# EAGLE design cape (EAGLE 7.5.0)
CNAME: Sebastián Sáez
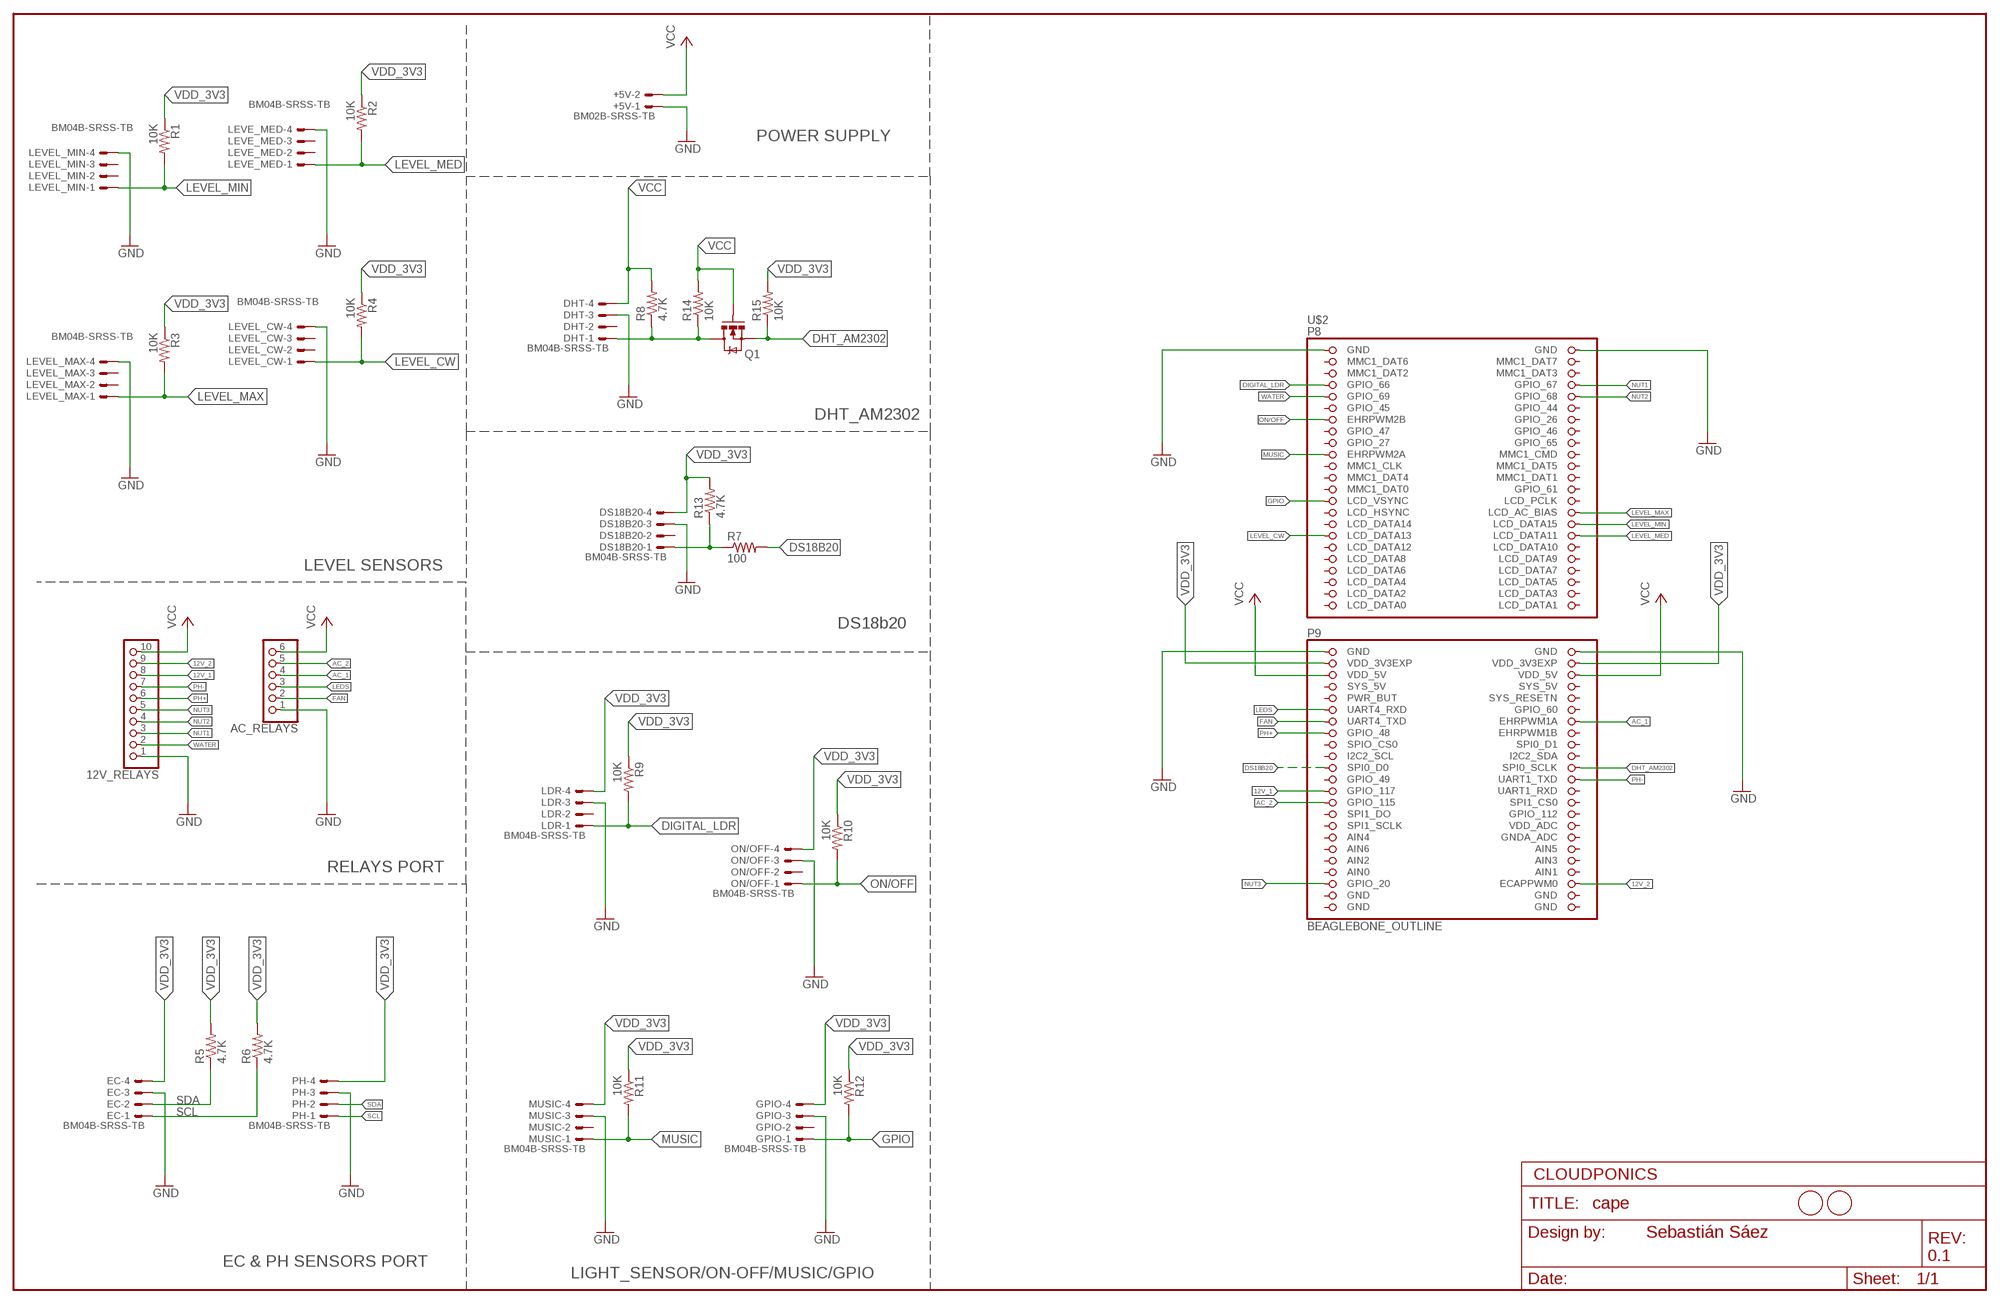
[diagram p0: schematic, sheet 1]

## Parts
12V_RELAYS  PINHD-1X10  [1X10-BIG]
+5V  BM02B-SRSS-TB  [BM02B-SRSS-TB]
AC_RELAYS  PINHD-1X6B  [1X06-BIG]
DHT  BM04B-SRSS-TB  [BM04B-SRSS-TB]
DS18B20  BM04B-SRSS-TB  [BM04B-SRSS-TB]
EC  BM04B-SRSS-TB  [BM04B-SRSS-TB]
FRAME1  FRAME-LEDGER  [CREATIVE_COMMONS]
GPIO  BM04B-SRSS-TB  [BM04B-SRSS-TB]
LDR  BM04B-SRSS-TB  [BM04B-SRSS-TB]
LEVE_MED  BM04B-SRSS-TB  [BM04B-SRSS-TB]
LEVEL_CW  BM04B-SRSS-TB  [BM04B-SRSS-TB]
LEVEL_MAX  BM04B-SRSS-TB  [BM04B-SRSS-TB]
LEVEL_MIN  BM04B-SRSS-TB  [BM04B-SRSS-TB]
MUSIC  BM04B-SRSS-TB  [BM04B-SRSS-TB]
ON/OFF  BM04B-SRSS-TB  [BM04B-SRSS-TB]
PH  BM04B-SRSS-TB  [BM04B-SRSS-TB]
Q1  MOSFET-NCHANNELBSS123LT1G  [SOT23-3]
R1  10K  R-US_R0805  [R0805]
R2  10K  R-US_R0805  [R0805]
R3  10K  R-US_R0805  [R0805]
R4  10K  R-US_R0805  [R0805]
R5  4.7K  R-US_R0805  [R0805]
R6  4.7K  R-US_R0805  [R0805]
R7  100  R-US_R0805  [R0805]
R8  4.7K  R-US_R0805  [R0805]
R9  10K  R-US_R0805  [R0805]
R10  10K  R-US_R0805  [R0805]
R11  10K  R-US_R0805  [R0805]
R12  10K  R-US_R0805  [R0805]
R13  4.7K  R-US_R0805  [R0805]
R14  10K  R-US_R0805  [R0805]
R15  10K  R-US_R0805  [R0805]
U$1  FIDUCIAL  [FIDUCIAL_1MM]
U$2  BEAGLEBONE_OUTLINE  [BEAGLEBONE_SHIELD]
U$3  FIDUCIAL  [FIDUCIAL_1MM]

## Nets
12V_1: 12V_RELAYS.8 U$2.71(GPIO_117)
12V_2: 12V_RELAYS.9 U$2.88(ECAPPWM0)
AC_1: AC_RELAYS.4 U$2.60(EHRPWM1A)
AC_2: AC_RELAYS.5 U$2.73(GPIO_115)
DHT_AM2302: Q1.2(S) R15.1 U$2.68(SPI0_SCLK)
DIGITAL_LDR: LDR.1 R9.2 U$2.7(GPIO_66)
DS18B20: R7.2 U$2.67(SPI0_D0)
FAN: AC_RELAYS.2 U$2.59(UART4_TXD)
GND: 12V_RELAYS.1 +5V.1 AC_RELAYS.1 DHT.3 DS18B20.3 EC.3 GPIO.3 LDR.3 LEVE_MED.4 LEVEL_MAX.4 LEVEL_MIN.4 MUSIC.3 ON/OFF.3 PH.3 U$2.1(GND) U$2.2(GND) U$2.47(GND) U$2.48(GND)
GPIO: GPIO.1 R12.2 U$2.27(LCD_VSYNC)
LEDS: AC_RELAYS.3 U$2.57(UART4_RXD)
LEVE_CW: LEVEL_CW.4 ; supply symbol labelled GND
LEVEL_CW: LEVEL_CW.1 R4.2 U$2.33(LCD_DATA13)
LEVEL_MAX: LEVEL_MAX.1 R3.2 U$2.30(LCD_AC_BIAS)
LEVEL_MED: LEVE_MED.1 R2.2 U$2.34(LCD_DATA11)
LEVEL_MIN: LEVEL_MIN.1 R1.2 U$2.32(LCD_DATA15)
MUSIC: MUSIC.1 R11.2 U$2.19(EHRPWM2A)
N1: DS18B20.1 R7.1 R13.1
N$1: DHT.1 Q1.3(D) R8.1 R14.1
NUT1: 12V_RELAYS.3 U$2.8(GPIO_67)
NUT2: 12V_RELAYS.4 U$2.10(GPIO_68)
NUT3: 12V_RELAYS.5 U$2.87(GPIO_20)
ON/OFF: ON/OFF.1 R10.2 U$2.13(EHRPWM2B)
PH+: 12V_RELAYS.6 U$2.61(GPIO_48)
PH-: 12V_RELAYS.7 U$2.70(UART1_TXD)
SCL: EC.1 PH.1 R6.1
SDA: EC.2 PH.2 R5.1
VCC: 12V_RELAYS.10 +5V.2 AC_RELAYS.6 DHT.4 Q1.1(G) R8.2 R14.2 U$2.51(VDD_5V) U$2.52(VDD_5V)
VDD_3V3: DS18B20.4 EC.4 GPIO.4 LDR.4 MUSIC.4 ON/OFF.4 PH.4 R1.1 R2.1 R3.1 R4.1 R5.2 R6.2 R9.1 R10.1 R11.1 R12.1 R13.2 R15.2 U$2.49(VDD_3V3EXP) U$2.50(VDD_3V3EXP)
WATER: 12V_RELAYS.2 U$2.9(GPIO_69)
Unconnected: DHT.2 DS18B20.2 GPIO.2 LDR.2 LEVE_MED.2 LEVE_MED.3 LEVEL_CW.2 LEVEL_CW.3 LEVEL_MAX.2 LEVEL_MAX.3 LEVEL_MIN.2 LEVEL_MIN.3 MUSIC.2 ON/OFF.2 U$2.3(MMC1_DAT6) U$2.4(MMC1_DAT7) U$2.5(MMC1_DAT2) U$2.6(MMC1_DAT3) U$2.11(GPIO_45) U$2.12(GPIO_44) U$2.14(GPIO_26) U$2.15(GPIO_47) U$2.16(GPIO_46) U$2.17(GPIO_27) U$2.18(GPIO_65) U$2.20(MMC1_CMD) U$2.21(MMC1_CLK) U$2.22(MMC1_DAT5) U$2.23(MMC1_DAT4) U$2.24(MMC1_DAT1) U$2.25(MMC1_DAT0) U$2.26(GPIO_61) U$2.28(LCD_PCLK) U$2.29(LCD_HSYNC) U$2.31(LCD_DATA14) U$2.35(LCD_DATA12) U$2.36(LCD_DATA10) U$2.37(LCD_DATA8) U$2.38(LCD_DATA9) U$2.39(LCD_DATA6) U$2.40(LCD_DATA7) U$2.41(LCD_DATA4) U$2.42(LCD_DATA5) U$2.43(LCD_DATA2) U$2.44(LCD_DATA3) U$2.45(LCD_DATA0) U$2.46(LCD_DATA1) U$2.54(SYS_5V) U$2.55(PWR_BUT) U$2.56(SYS_RESETN) U$2.58(GPIO_60) U$2.62(EHRPWM1B) U$2.63(SPIO_CS0) U$2.64(SPI0_D1) U$2.65(I2C2_SCL) U$2.66(I2C2_SDA) U$2.69(GPIO_49) U$2.72(UART1_RXD) U$2.74(SPI1_CS0) U$2.75(SPI1_DO) U$2.76(GPIO_112) U$2.77(SPI1_SCLK) U$2.78(VDD_ADC) U$2.79(AIN4) U$2.80(GNDA_ADC) U$2.81(AIN6) U$2.82(AIN5) U$2.83(AIN2) U$2.84(AIN3) U$2.86(AIN1)

## Notes on the sheet
- POWER SUPPLY
- DHT_AM2302
- LEVEL SENSORS
- DS18b20
- RELAYS PORT
- EC & PH SENSORS PORT
- LIGHT_SENSOR/ON-OFF/MUSIC/GPIO

## Power pins joined to a net without a drawn wire
AIN0: U$2.85(AIN0)
GND: U$2.89(GND) U$2.90(GND) U$2.91(GND) U$2.92(GND)
SYS_5V: U$2.53(SYS_5V)

## Library data of the parts
12V_RELAYS = adafruit:PINHD-1X10: Pin header 1x10 0.1" spacing With round pins
+5V = con-jst:?M02B-SRSS-TB: Disconnectable Crimp style connector, 1.0mm pitch 2 contacts
AC_RELAYS = adafruit:PINHD-1X6: PIN HEADER
DHT DS18B20 EC GPIO LDR LEVE_MED LEVEL_CW LEVEL_MAX LEVEL_MIN MUSIC ON/OFF PH = con-jst:?M04B-SRSS-TB: Disconnectable Crimp style connector, 1.0mm pitch 4 contacts
FRAME1 = SparkFun-Aesthetics:FRAME-LEDGER: Schematic Frame Standard 11x14 US Ledger frame
Q1 = SparkFun-DiscreteSemi:MOSFET-NCHANNEL: Common NMOSFET Parts MFG P/N Store ID Prod ID FDD8780 TRANS-09984 SI7820DN TRANS-11055 FDS6630A IC-08089 2N7002PW TRANS-11151 FQP30N06L COM-10213 TRANS-10060 BSS123LT1G TRANS-08345 BSS138 TRANS-00830 BS170 2N7000; PROD_ID: TRANS-08345
R1-R15 = adafruit:R-US_: RESISTOR, American symbol
U$1 U$3 = adafruit:FIDUCIAL: For use by pick and place machines to calibrate the vision/machine, 1mm By microbuilder.eu
U$2 = adafruit:BEAGLEBONE_OUTLINE: Should match A3 pinout - but not completely tested

## Board
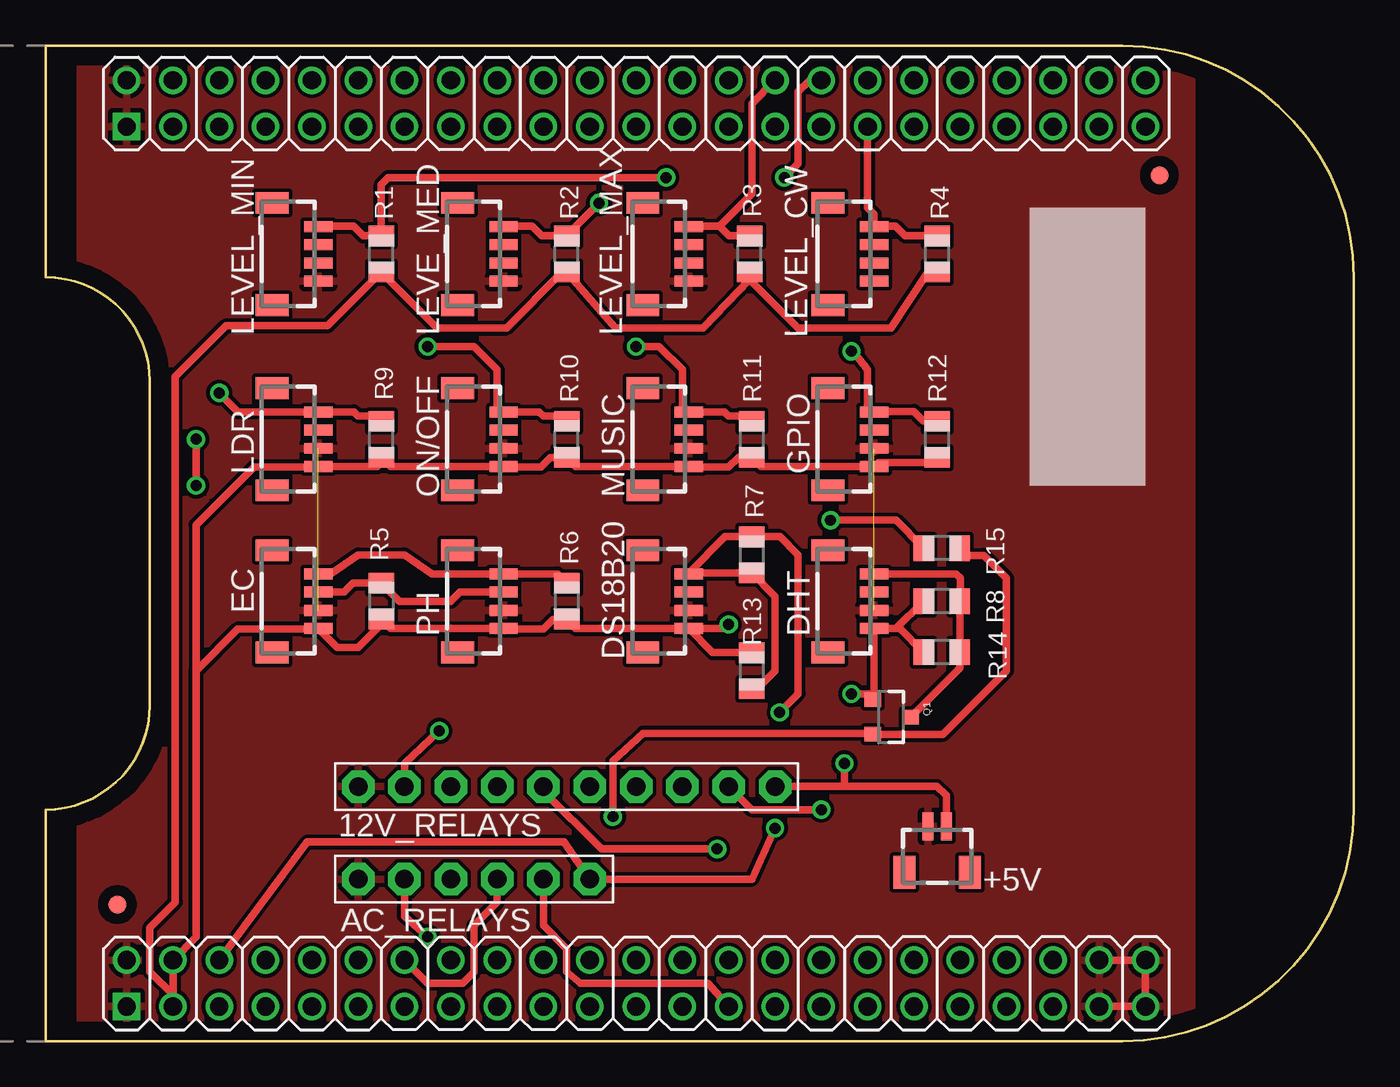
[diagram p1: board, top side]
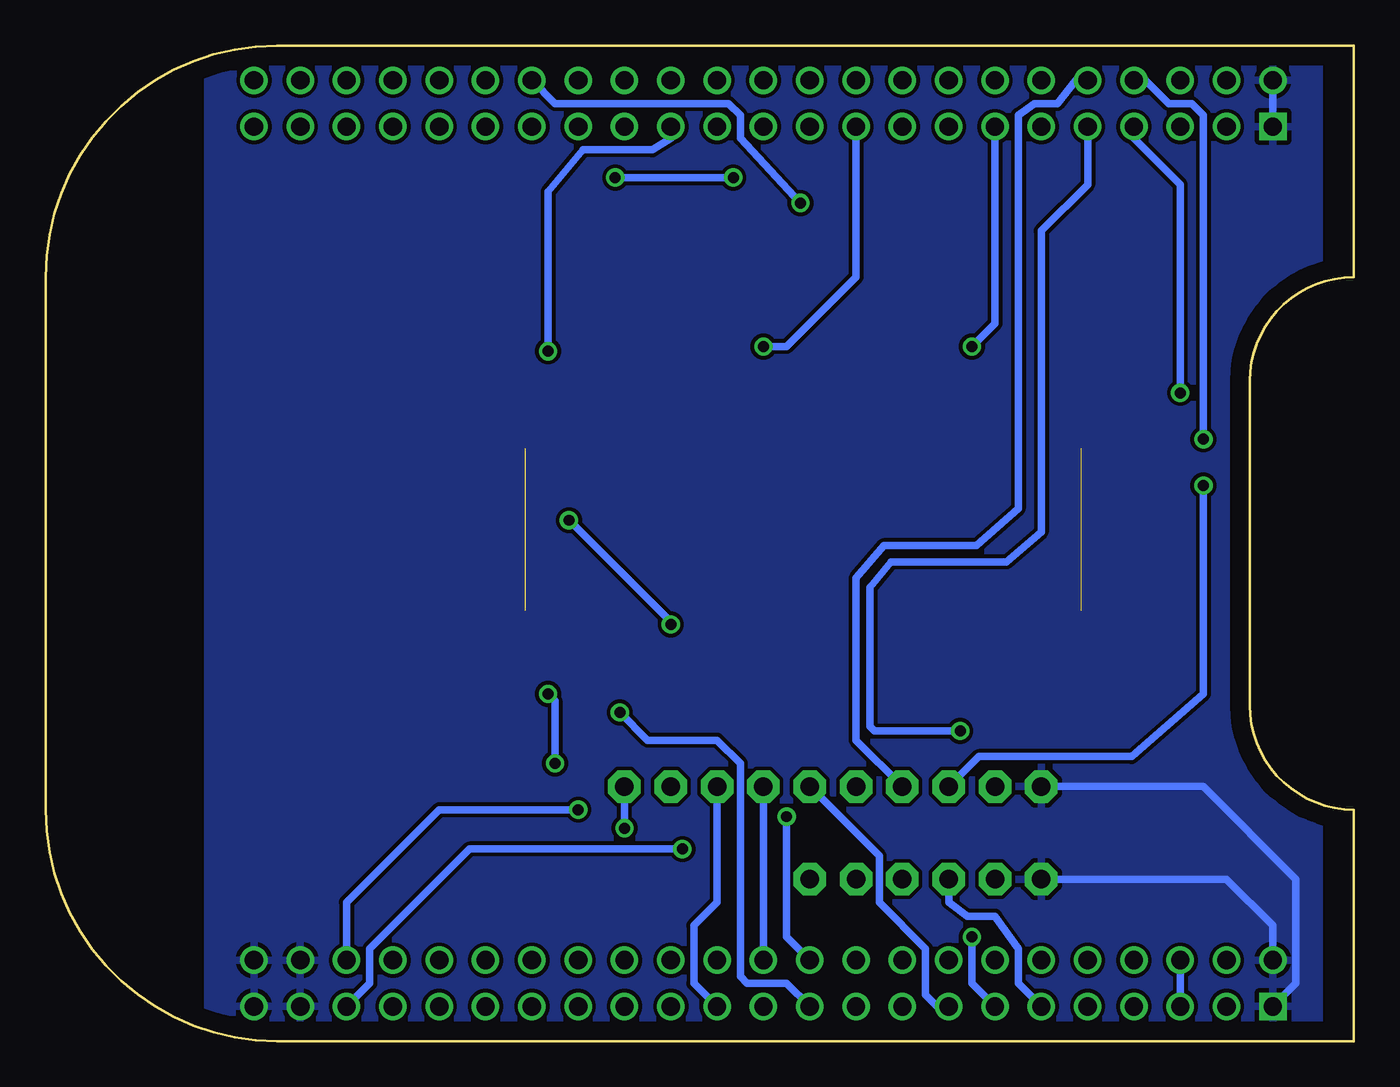
[diagram p2: board, bottom side, seen from below]

Size 71.75 x 54.61 mm. Coordinates in mm from the lower left corner, seen from the top.
Copper layers (1*16): Top 0.035mm / dielectric 1.5mm / Bottom 0.035mm
Design rules "default": minimum track width 10mil, minimum drill 24mil, track to track 8mil, track to pad 8mil, pad to pad 8mil, via to via 8mil, smd to smd 8mil, copper to edge 40mil, drill to drill 8mil, minimum pad ring 10mil, minimum via ring 8mil, stop-mask expansion 4mil, vias tented up to drill 0mil, thermal gap 10mil

### Footprints (pad centres in the part's own frame; a part is rotated, then mirrored left to right if it is on the bottom)
1X10-BIG = drill 1.016 pad 1.778 octagon: 1 -11.43,0; 2 -8.89,0; 3 -6.35,0; 4 -3.81,0; 5 -1.27,0; 6 1.27,0; 7 3.81,0; 8 6.35,0; 9 8.89,0; 10 11.43,0
BM02B-SRSS-TB = smd 0.6 x 1.55: 1 0.5,-1.625; 2 -0.5,-1.625 | smd 1.2 x 1.8: FIT@1 1.8,0.9; FIT@2 -1.8,0.9
1X06-BIG = drill 1.016 pad 1.778 octagon: 1 -6.35,0; 2 -3.81,0; 3 -1.27,0; 4 1.27,0; 5 3.81,0; 6 6.35,0
BM04B-SRSS-TB = smd 0.6 x 1.55: 1 1.5,-1.625; 2 0.5,-1.625; 3 -0.5,-1.625; 4 -1.5,-1.625 | smd 1.2 x 1.8: FIT@1 2.8,0.9; FIT@2 -2.8,0.9
SOT23-3 = smd 0.8 x 0.9: 1 -0.95,-1; 2 0.95,-1; 3 0,1.1
R0805 = smd 1.1 x 1.4: 1 -1,0; 2 1,0
FIDUCIAL_1MM = smd 1 x 1: 1 0,0
BEAGLEBONE_SHIELD = drill 1 square: 1 4.445,19.05; 47 52.705,19.05 | drill 1: 2 1.905,19.05; 3 4.445,21.59; 4 1.905,21.59; 5 4.445,24.13; 6 1.905,24.13; 7 4.445,26.67; 8 1.905,26.67; 9 4.445,29.21; 10 1.905,29.21; 11 4.445,31.75; 12 1.905,31.75; 13 4.445,34.29; 14 1.905,34.29; 15 4.445,36.83; 16 1.905,36.83; 17 4.445,39.37; 18 1.905,39.37; 19 4.445,41.91; 20 1.905,41.91; 21 4.445,44.45; 22 1.905,44.45; 23 4.445,46.99; 24 1.905,46.99; 25 4.445,49.53; 26 1.905,49.53; 27 4.445,52.07; 28 1.905,52.07; 29 4.445,54.61; 30 1.905,54.61; 31 4.445,57.15; 32 1.905,57.15; 33 4.445,59.69; 34 1.905,59.69; 35 4.445,62.23; 36 1.905,62.23; 37 4.445,64.77; 38 1.905,64.77; 39 4.445,67.31; 40 1.905,67.31; 41 4.445,69.85; 42 1.905,69.85; 43 4.445,72.39; 44 1.905,72.39; 45 4.445,74.93; 46 1.905,74.93; 48 50.165,19.05; 49 52.705,21.59; 50 50.165,21.59; 51 52.705,24.13; 52 50.165,24.13; 53 52.705,26.67; 54 50.165,26.67; 55 52.705,29.21; 56 50.165,29.21; 57 52.705,31.75; 58 50.165,31.75; 59 52.705,34.29; 60 50.165,34.29; 61 52.705,36.83; 62 50.165,36.83; 63 52.705,39.37; 64 50.165,39.37; 65 52.705,41.91; 66 50.165,41.91; 67 52.705,44.45; 68 50.165,44.45; 69 52.705,46.99; 70 50.165,46.99; 71 52.705,49.53; 72 50.165,49.53; 73 52.705,52.07; 74 50.165,52.07; 75 52.705,54.61; 76 50.165,54.61; 77 52.705,57.15; 78 50.165,57.15; 79 52.705,59.69; 80 50.165,59.69; 81 52.705,62.23; 82 50.165,62.23; 83 52.705,64.77; 84 50.165,64.77; 85 52.705,67.31; 86 50.165,67.31; 87 52.705,69.85; 88 50.165,69.85; 89 52.705,72.39; 90 50.165,72.39; 91 52.705,74.93; 92 50.165,74.93

### Placement (x,y rotation side)
12V_RELAYS  28.57,13.97 0 top
+5V  48.89,10.16 180 top
AC_RELAYS  23.5,8.89 0 top
DHT  43.81,24.13 90 top
DS18B20  33.66,24.13 90 top
EC  13.33,24.13 90 top
FRAME1  5.71,-12.7 0 top  (outside the outline)
GPIO  43.81,33.02 90 top
LDR  13.33,33.02 90 top
LEVE_MED  23.5,43.18 90 top
LEVEL_CW  43.81,43.18 90 top
LEVEL_MAX  33.66,43.18 90 top
LEVEL_MIN  13.33,43.18 90 top
MUSIC  33.66,33.02 90 top
ON/OFF  23.5,33.02 90 top
PH  23.5,24.13 90 top
Q1  46.35,17.78 270 top
R1  18.41,43.18 90 top
R2  28.57,43.18 90 top
R3  38.61,43.18 90 top
R4  48.89,43.18 90 top
R5  18.41,24.13 270 top
R6  28.57,24.13 270 top
R7  38.73,26.67 90 top
R8  49.15,24.13 180 top
R9  18.41,33.02 90 top
R10  28.57,33.02 90 top
R11  38.73,33.02 90 top
R12  48.89,33.02 90 top
R13  38.73,20.32 90 top
R14  49.15,21.34 180 top
R15  49.15,27.05 180 top
U$1  3.94,7.49 0 top
U$2  -14.61,54.61 270 top
U$3  61.09,47.5 0 top

### Tracks (layer width: path | path; a pad name or v marks a point on that pad's centre or on a via)
12V_1
  Bottom 0.406: 12V_RELAYS.8 34.92,7.62 36.19,6.35 36.19,3.17 U$2.71
12V_2  (via drill 0.6)
  Top 0.406: 12V_RELAYS.9 38.73,12.7 v42.55,12.7
  Bottom 0.406: v42.55,12.7 50.16,12.7 55.24,7.62 U$2.88
AC_1
  Top 0.406: AC_RELAYS.4 24.76,7.62 23.5,6.35 23.5,3.81 22.86,3.17 20.96,3.17 U$2.60
AC_2
  Top 0.406: AC_RELAYS.5 27.3,6.35 28.57,5.08 28.57,3.81 29.34,3.17 36.32,3.17 U$2.73
DHT_AM2302  (via drill 0.6)
  Top 0.406: v31.11,12.32 31.11,15.37 32.77,16.89 44.91,16.89 Q1.2 49.21,16.83 52.7,20.32 52.7,25.4 51.45,26.65 50.55,26.65 R15.1
  Bottom 0.406: v31.11,12.32 31.11,5.71 U$2.68
DIGITAL_LDR  (via drill 0.6)
  Top 0.406: v9.53,35.56 10.57,34.52 LDR.1 16.91,34.52 17.14,34.29 18.14,34.29 R9.2
  Bottom 0.406: v9.53,35.56 9.53,46.99 12.07,49.53 U$2.7
DS18B20  (via drill 0.6)
  Top 0.406: 35.26,25.65 37.27,27.67 R7.2 40.28,27.67 41.27,26.67 41.27,19.05 v40.26,18.03
  Bottom 0.406: U$2.67 31.11,3.17 33.27,3.17 33.66,3.56 33.66,15.24 34.92,16.51 38.73,16.51 v40.26,18.03
FAN  (via drill 0.6)
  Top 0.406: v20.96,5.71 19.68,6.86 AC_RELAYS.2
  Bottom 0.406: U$2.59 20.96,3.17 v20.96,5.71
GND  (2 unrouted)
  Top 0.406: U$2.89 U$2.91 U$2.92 U$2.90
  Bottom 0.406: U$2.2 U$2.1 | U$2.48 4.45,6.35 6.98,8.89 AC_RELAYS.1 | 12V_RELAYS.1 8.25,13.97 3.18,8.89 3.18,3.17 U$2.47
  pour Bottom: 1.9,54.61 62.86,54.61 62.86,0 1.9,0
  pour Top: 1.9,54.61 62.86,54.61 62.86,0 1.9,0
GPIO  (via drill 0.6)
  Top 0.406: R12.2 48.15,34.02 47.62,34.54 45.46,34.54 GPIO.1 45.08,34.88 45.08,36.83 44.58,37.46 v44.2,37.85
  Bottom 0.406: v44.2,37.85 44.2,46.61 42.29,48.89 38.48,48.89 37.47,49.53 U$2.27
LEDS
  Bottom 0.406: U$2.57 18.41,3.17 18.41,5.08 19.68,6.86 21.21,6.86 22.22,7.62 AC_RELAYS.3
LEVEL_CW
  Top 0.406: R4.2 47.13,44.18 46.61,44.7 45.46,44.7 LEVEL_CW.1 45.44,45.36 45.08,45.72 U$2.33
LEVEL_MAX
  Top 0.406: LEVEL_MAX.1 35.3,44.7 36.96,44.7 | 36.96,44.7 37.48,44.18 R3.2 | 36.96,44.7 38.73,46.48 38.73,51.44 U$2.30
LEVEL_MED  (via drill 0.6)
  Top 0.406: v30.35,45.97 R2.2 27.19,44.18 26.67,44.7 25.14,44.7 LEVE_MED.1
  Bottom 0.406: v30.35,45.97 33.66,49.53 33.66,50.8 34.29,51.44 43.81,51.44 U$2.34
LEVEL_MIN  (via drill 0.6)
  Top 0.406: LEVEL_MIN.1 14.98,44.7 16.89,44.7 17.41,44.18 R1.2 18.41,46.99 18.8,47.37 v34.04,47.37 | U$2.32 41.91,52.7 41.27,52.07 41.27,48.13 v40.51,47.37
  Bottom 0.406: v40.51,47.37 v34.04,47.37
MUSIC  (via drill 0.6)
  Top 0.406: R11.2 38.47,34.29 37.47,34.29 37.23,34.52 MUSIC.1 34.92,34.88 34.92,36.83 33.66,38.1 v32.39,38.1
  Bottom 0.406: U$2.19 27.3,41.91 31.11,38.1 v32.39,38.1
N1
  Top 0.406: DS18B20.1 35.32,25.67 R7.1 40,24.4 40,20.32 39,19.32 R13.1
N$1
  Top 0.406: 47.47,17.8 Q1.3 50.15,20.47 R14.1 R8.1 50.16,24.15 50.16,25.4 49.94,25.63 DHT.1
NUT1  (via drill 0.6)
  Top 0.406: v8.25,33.02 v8.25,30.48
  Bottom 0.406: U$2.8 11.43,52.7 10.16,51.44 8.89,51.44 8.25,50.8 v8.25,33.02 | 12V_RELAYS.3 20.57,15.62 12.19,15.62 8.25,19.05 v8.25,30.48
NUT2
  Bottom 0.406: U$2.10 15.24,52.7 16.26,51.44 17.53,51.44 18.41,50.8 18.41,29.21 20.7,27.18 25.78,27.18 27.3,25.4 27.3,16.51 12V_RELAYS.4
NUT3  (via drill 0.6)
  Top 0.406: 12V_RELAYS.5 27.3,13.72 30.48,10.54 v36.83,10.54
  Bottom 0.406: v36.83,10.54 48.51,10.54 53.97,5.08 53.97,3.17 U$2.87
ON/OFF  (via drill 0.6)
  Top 0.406: 28.57,34.29 R10.2 28.3,34.29 27.3,34.29 27.07,34.52 ON/OFF.1 24.76,34.88 24.76,36.83 23.5,38.1 v20.96,38.1
  Bottom 0.406: U$2.13 19.68,39.37 v20.96,38.1
PH+
  Bottom 0.406: U$2.61 22.86,1.9 23.5,2.54 23.5,5.08 26.04,7.62 26.04,10.16 12V_RELAYS.6
PH-
  Bottom 0.406: U$2.70 12V_RELAYS.7
SCL
  Top 0.406: R6.1 28.07,25.63 PH.1 21.18,25.63 19.68,26.67 17.14,26.67 15.64,25.63 EC.1
SDA
  Top 0.406: EC.2 14.97,24.64 16.38,24.64 16.87,25.13 R5.1 19.41,24.13 22.22,24.13 22.72,24.63 PH.2
VCC  (via drill 0.6)
  Top 0.406: U$2.52 14.35,10.92 28.45,10.92 AC_RELAYS.6 38.73,8.89 v40,11.68 | 49.39,12.2 +5V.2 49.39,13.47 48.89,13.97 43.81,13.97 | 12V_RELAYS.10 43.81,13.97 | v44.2,19.05 45.12,19.05 45.35,18.81 Q1.1 45.44,18.81 DHT.4 46.65,22.63 | 46.65,22.63 R8.2 | v43.81,15.24 43.81,13.97 | 46.65,22.63 46.85,22.63 R14.2
  Bottom 0.406: U$2.52 U$2.51 | v44.2,19.05 43.81,18.67 v43.81,15.24 | v40,11.68 12V_RELAYS.10
VDD_3V3  (via drill 0.6)
  Top 0.406: 28.57,22.86 R6.2 | R6.2 27.83,23.13 27.3,22.61 25.14,22.61 PH.4 18.91,22.63 R5.2 18.41,22.86 17.14,21.59 16,21.59 EC.4 14.94,22.61 10.54,22.61 8.25,20.32 | 18.14,31.75 R9.1 18.91,31.52 ON/OFF.4 25.14,31.5 27.18,31.5 27.7,32.02 R10.1 29.07,31.52 MUSIC.4 35.3,31.5 37.47,31.5 37.99,32.02 R11.1 39.23,31.52 GPIO.4 45.67,31.75 48.89,31.75 R12.1 | U$2.49 6.98,2.54 | 6.98,2.54 5.71,3.81 5.71,6.22 7.11,7.62 7.11,36.45 9.91,39.24 15.48,39.24 R1.1 21.48,39.12 25.27,39.12 28.34,42.18 R2.1 31.26,39.12 36.07,39.12 38.61,41.78 | 38.61,41.78 R3.1 | 38.61,41.78 41.27,39.12 46.35,39.12 48.4,42.18 R4.1 | 17.91,31.52 LDR.4 14.94,31.5 11.43,31.5 8.25,28.32 8.25,20.32 | 17.91,31.52 18.18,31.52 18.41,31.75 18.14,31.75 | 18.14,31.75 17.91,31.52 | 6.98,2.54 U$2.50 8.25,5.71 8.25,20.32 | DS18B20.4 36.59,21.32 R13.2 | R6.2 29.07,22.63 DS18B20.4 | v37.47,22.86 37.23,22.63 DS18B20.4 | v43.05,28.57 46.62,28.57 R15.2
  Bottom 0.406: v43.05,28.57 37.47,22.99 v37.47,22.86
WATER  (via drill 0.6)
  Top 0.406: 12V_RELAYS.2 19.68,15.24 v21.59,17.02
  Bottom 0.406: U$2.9 14.61,46.99 17.14,44.45 17.14,27.94 19.05,26.29 25.4,26.29 26.54,24.89 26.54,17.27 26.29,17.02 v21.59,17.02